# EasyEDA Pro project ProPrj_Y车Y形板_2025-09-30.epro, board 六边形主板
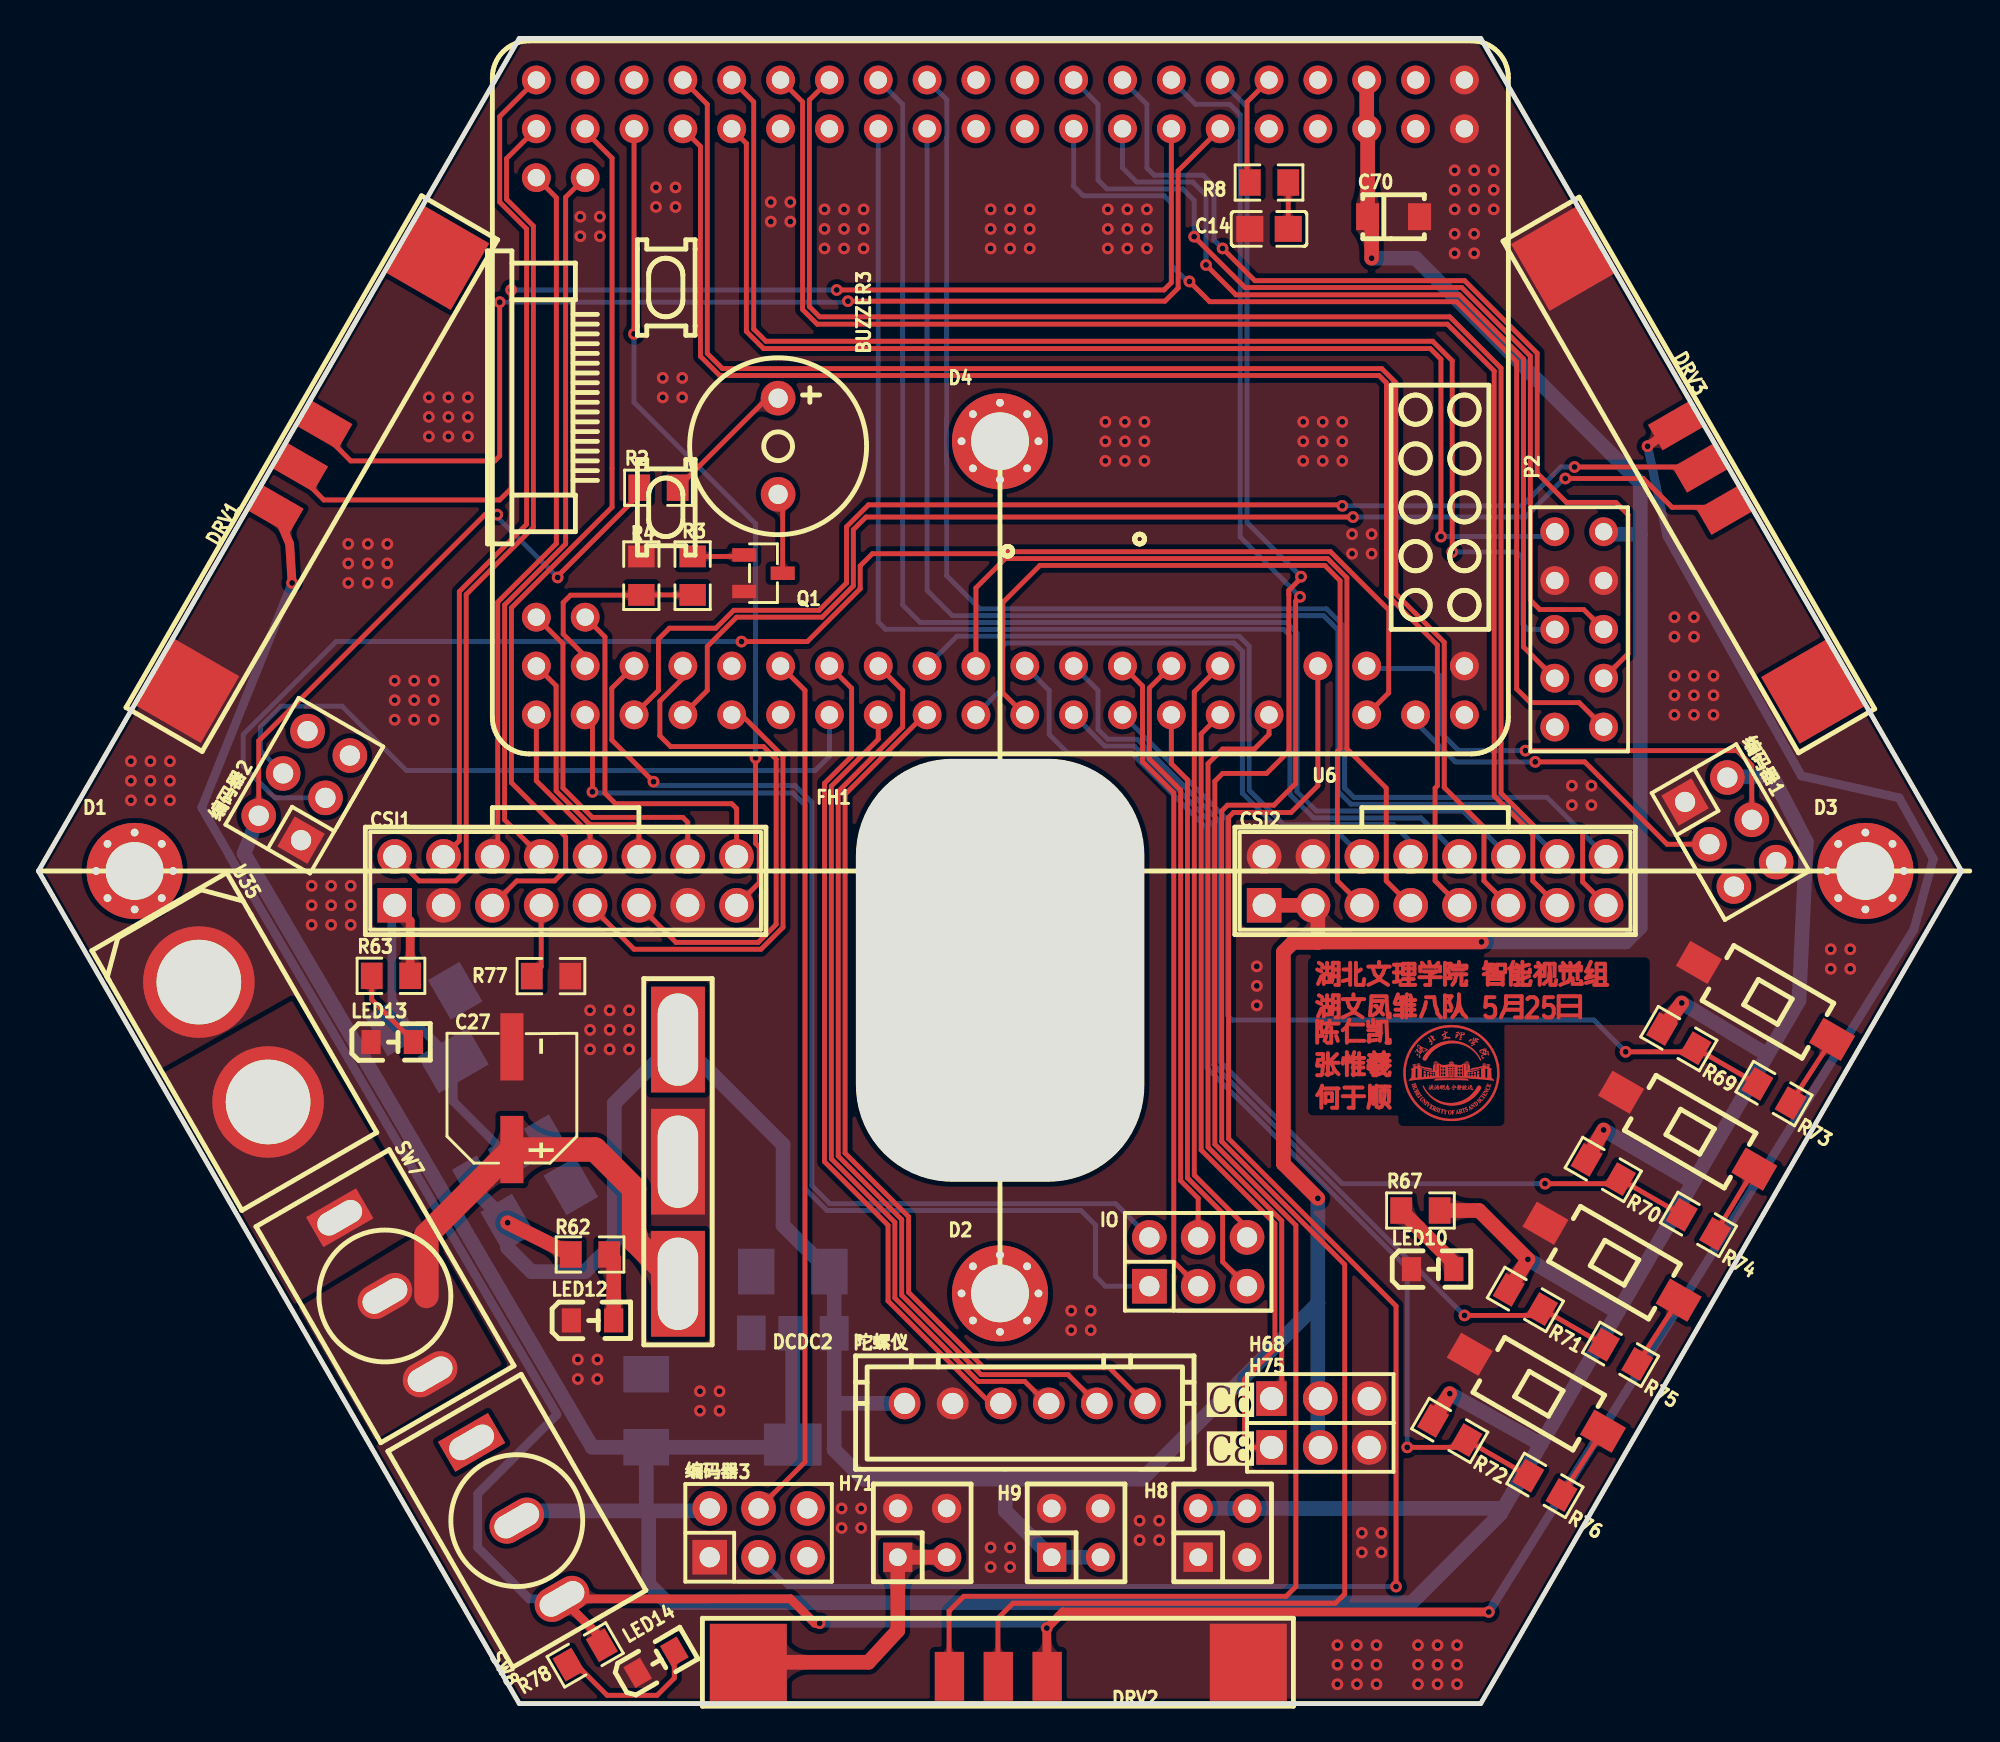
[diagram p14: board, top side]
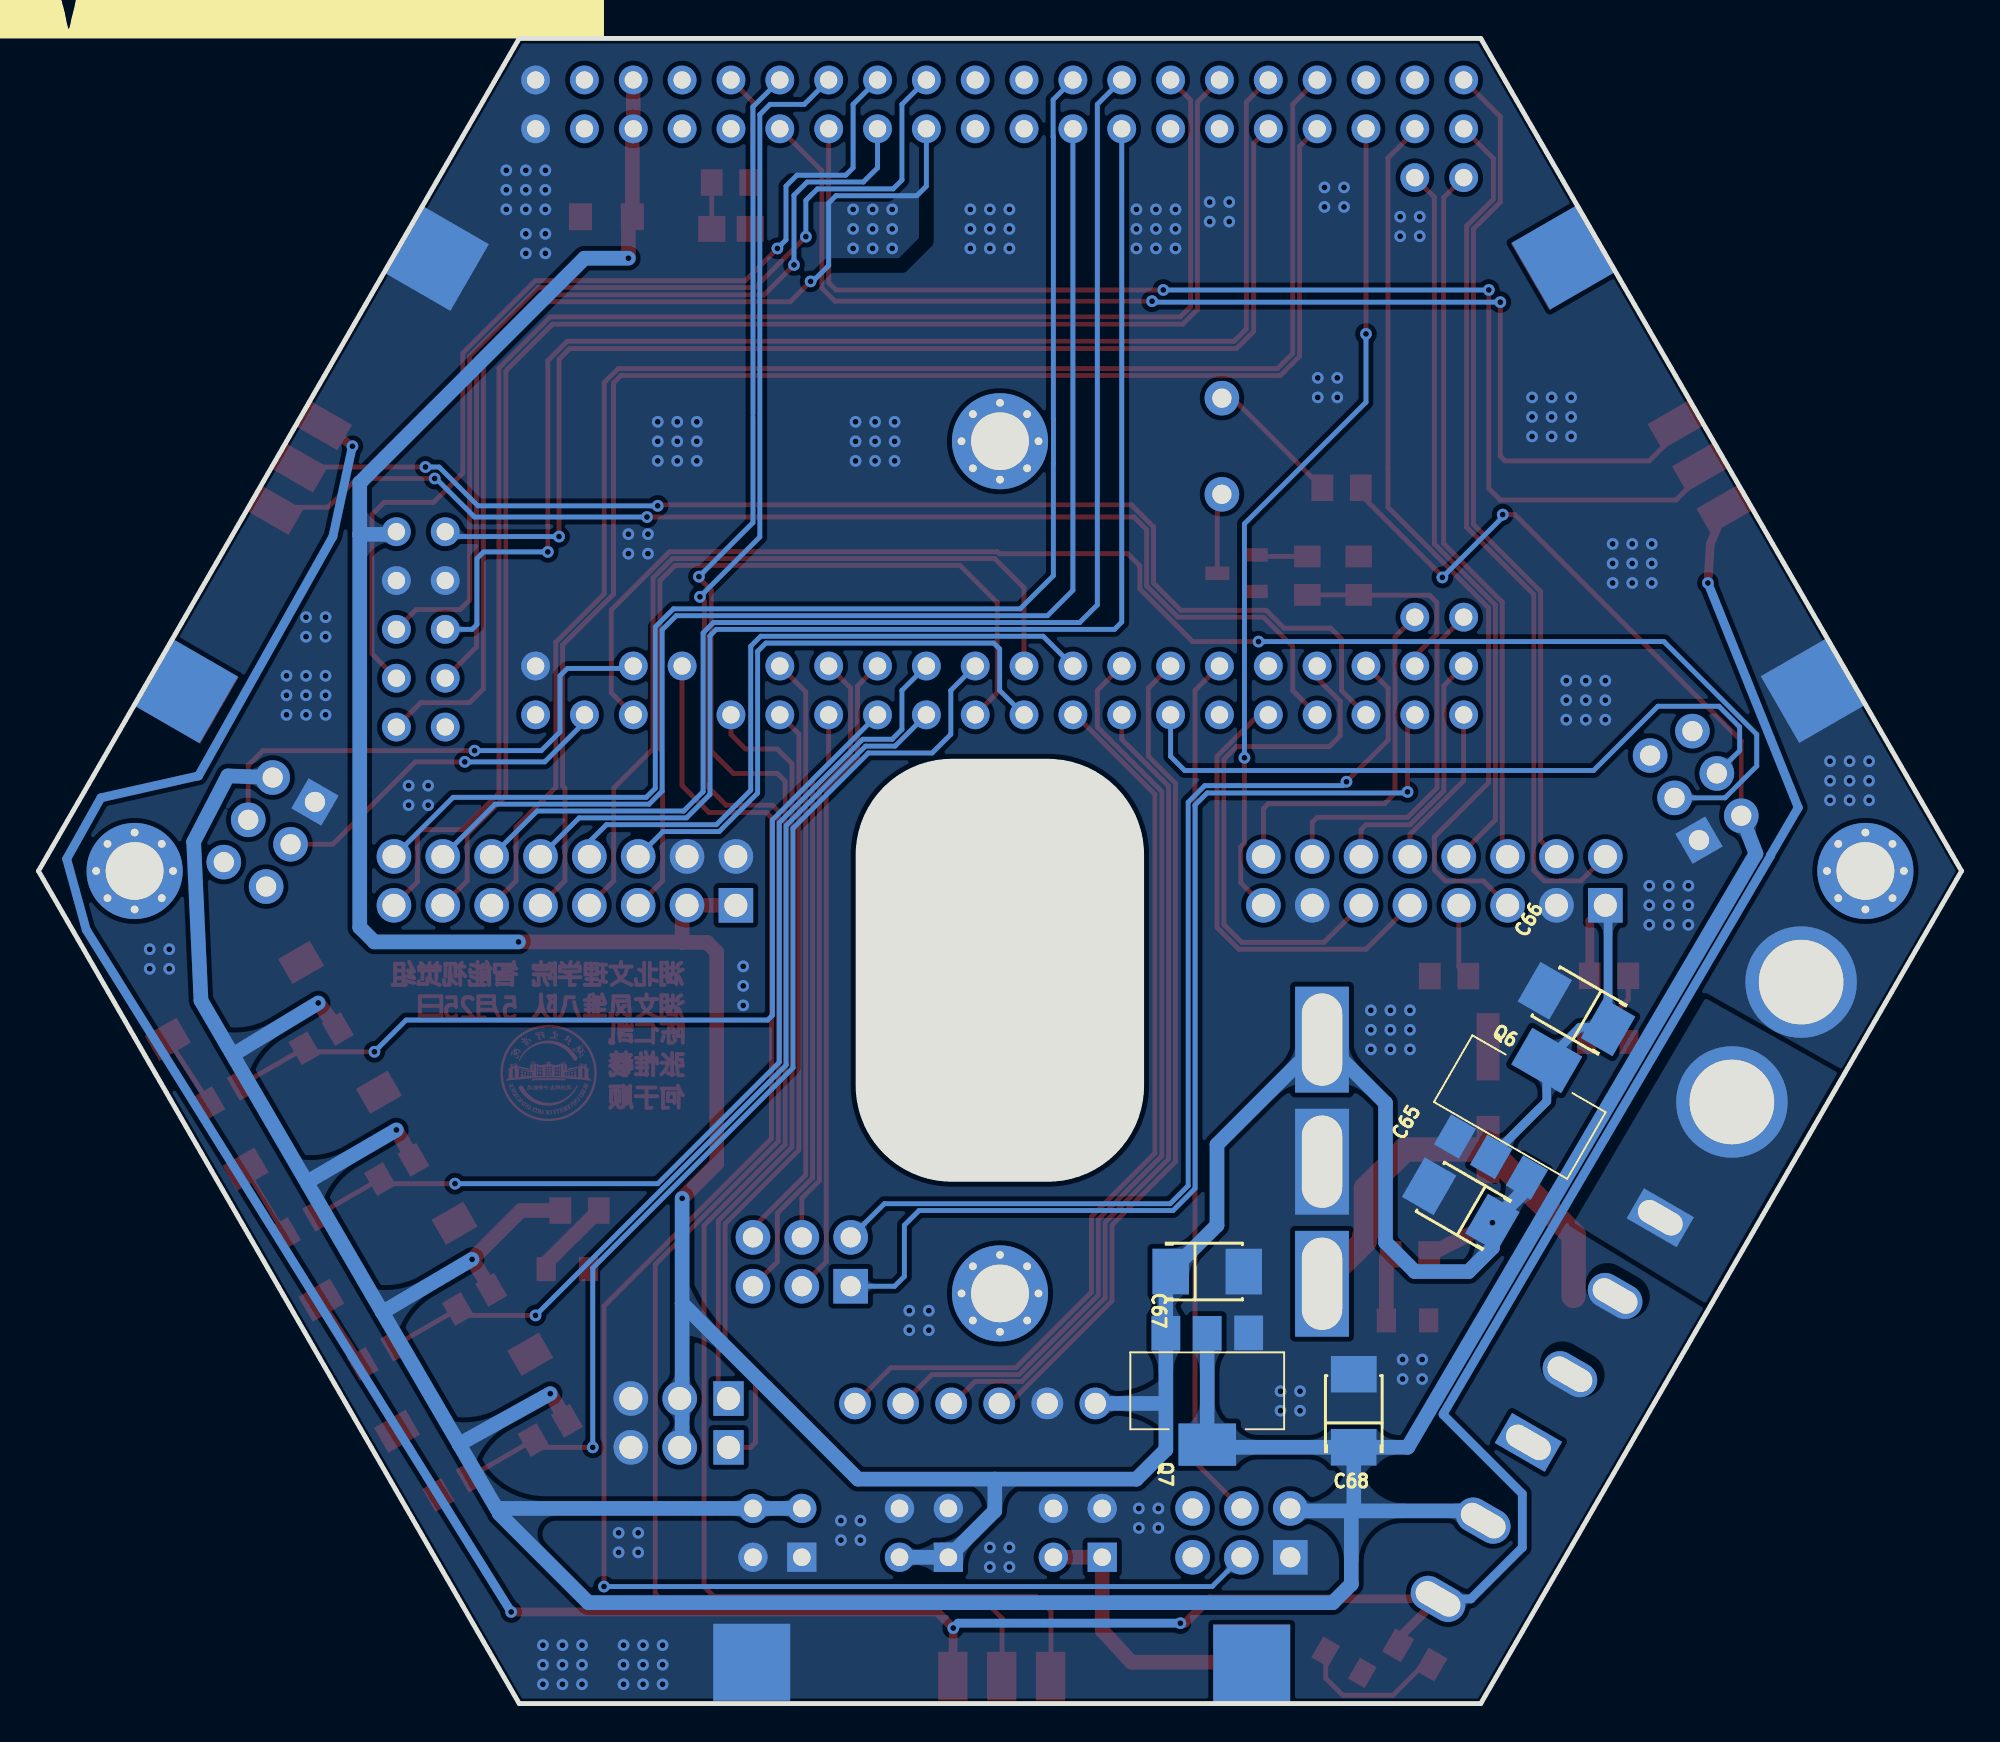
[diagram p15: board, bottom side, seen from below]

Outline 100 x 86.6 mm; copper layers: Top Layer, Bottom Layer. Coordinates in mm from the lower left corner of the outline.
Outline path: 0,43.3 25,86.6 75,86.6 100,43.3 75,0 25,0 0,43.3
Stack: Top Layer 0.035mm / Dielectric1 1.51mm FR4 er 4.5 / Bottom Layer 0.035mm

## Design rules (mm)
template: 自定义配置
spacing copperThickness1oz (default): track to track 0.102, other pairs 0.152 to 0.3
spacing copperThickness2oz: track to track 0.203, other pairs 0.152 to 0.3
track width copperThickness1oz (default): min 0.127, default 0.254, max 2.54
track width copperThickness2oz: min 0.203, default 0.254, max 2.54
differential pair differentialPair (default): width min 0.127, default 0.254, max 2.54; gap min 0.152, default 0.152
via viaSize (default): diameter min 0.5, default 0.61, max 10; hole min 0.3, default 0.305, max 6.3

## Placement (name value [footprint] x y rotation side)
BUZZER3  3kHz  [BUZ-TH_BD9.0-P5.00-D0.6-FD]  38.46 65.39 270 top
C1  TS-1101-C-W  [SW-SMD_L6.0-W3.3-LS8.0]  81.83 22.98 150 top
C12  TS-1101-C-W  [SW-SMD_L6.0-W3.3-LS8.0]  89.81 36.55 150 top
C13  TS-1101-C-W  [SW-SMD_L6.0-W3.3-LS8.0]  85.76 29.8 150 top
C14  10uF  [C0805]  63.99 76.7 0 top
C15  TS-1101-C-W  [SW-SMD_L6.0-W3.3-LS8.0]  77.89 16.17 150 top
C27  470uF  [CAP-SMD_BD6.3-L6.6-W6.6-LS7.2-FD]  24.62 31.48 90 top
C65  10uF  [CAP-SMD_L3.5-W2.8-R-RD]  26.04 25.96 210 bottom
C66  10uF  [CAP-SMD_L3.5-W2.8-R-RD]  20.02 36.12 210 bottom
C67  10uF  [CAP-SMD_L3.5-W2.8-R-RD]  39.22 22.47 0 bottom
C68  10uF  [CAP-SMD_L3.5-W2.8-R-RD]  31.6 15.23 270 bottom
C70  22uF  [CAP-SMD_L3.2-W1.6]  70.47 77.33 0 top
CSI1  2.54-2*8P针  [HDR-TH_16P-P2.54-V-M-R2-C8-S2.54]  27.41 42.79 0 top
CSI2  2.54-2*8P针  [HDR-TH_16P-P2.54-V-M-R2-C8-S2.54]  72.62 42.79 0 top
D1  -  [M3]  5 43.3 0 top
D2  -  [M3]  50 21.32 0 top
D3  -  [M3]  95 43.3 0 top
D4  -  [M3]  50 65.65 0 top
DCDC2  -  [TPS54540DC插槽]  33.25 21.83 180 top
DRV1  -  [DRV8701连接焊盘]  4.55 51.8 60 top
DRV2  -  [DRV8701连接焊盘]  65.26 -0.14 180 top
DRV3  -  [DRV8701连接焊盘]  80.12 78.35 300 top
FH1  智能车逐飞摄像头固定孔  [智能车逐飞摄像头支架固定孔]  50 40.37 0 top
H8  -  [HDR-TH_4P-P2.54-V-M-R2-C2-S2.54-1]  61.58 8.88 0 top
H9  -  [HDR-TH_4P-P2.54-V-M-R2-C2-S2.54-1]  53.96 8.88 0 top
H68  77311-102-03LF  [HDR-TH_3P-P2.54-V-M-1]  66.66 15.86 0 top
H71  -  [HDR-TH_4P-P2.54-V-M-R2-C2-S2.54-1]  45.96 8.88 0 top
H75  77311-102-03LF  [HDR-TH_3P-P2.54-V-M-1]  66.66 13.32 0 top
IO  67997-206HLF  [HDR-TH_6P-P2.54-V-M-R2-C3-S2.54-1]  60.31 22.98 0 top
LED10  NCD0805R1  [LED0805-RD]  72.5 22.59 0 top
LED12  NCD0805R1  [LED0805-RD]  28.81 19.93 0 top
LED13  NCD0805R1  [LED0805-RD]  18.4 34.41 0 top
LED14  NCD0805R1  [LED0805-RD]  32.11 2.15 30 top
P2  Header-D-F 2x5P  [HDR2X5-F]  78.85 60.95 270 top
Q1  S8050  [SOT-23-3_L2.9-W1.3-P1.90-LS2.4-BR]  37.7 58.79 180 top
Q6  AMS1117-3.3V  [AMS1117]  23.02 30.93 210 bottom
Q7  AMS1117-3.3V  [AMS1117]  39.22 16.37 0 bottom
R2  10R  [R0805]  32.24 63.23 0 top
R3  4.7K  [R0805]  34.02 58.66 90 top
R4  10K  [R0805]  31.35 58.66 90 top
R8  10K  [R0805]  63.99 79.11 0 top
R62  4.7K  [R0805]  28.68 23.36 180 top
R63  4.7K  [R0805]  18.33 37.85 0 top
R67  2.2K  [R0805]  71.86 25.64 0 top
R69  1kΩ  [R0805]  85.3 34.58 150 top
R70  1kΩ  [R0805]  81.37 27.78 150 top
R71  1kΩ  [R0805]  77.32 21.02 150 top
R72  1kΩ  [R0805]  73.39 14.2 150 top
R73  100Ω  [R0805]  90.25 31.73 150 top
R74  100Ω  [R0805]  86.32 24.92 150 top
R75  100Ω  [R0805]  82.27 18.16 150 top
R76  100Ω  [R0805]  78.34 11.35 150 top
R77  10K  [R0805]  26.65 37.83 0 top
R78  2.2K  [R0805]  28.43 2.53 30 top
SW7  MT-0-103-A101-M200-RS+PJ  [SW-TH_MT-0-103-A101-M200-RS]  18.02 21.2 300 top
SW8  MT-0-103-A101-M200-RS+PJ  [SW-TH_MT-0-103-A101-M200-RS]  24.87 9.51 300 top
U6  -  [AUFE_RT1064]  50.02 67.93 180 top
U35  XT60  [CONN-TH_XT60]  10.14 34.41 300 top
编码器1  67997-206HLF  [HDR-TH_6P-P2.54-V-M-R2-C3-S2.54-1]  87.99 45.33 300 top
编码器2  67997-206HLF  [HDR-TH_6P-P2.54-V-M-R2-C3-S2.54-1]  13.82 47.74 60 top
编码器3  67997-206HLF  [HDR-TH_6P-P2.54-V-M-R2-C3-S2.54-1]  37.45 8.88 0 top
陀螺仪  WAFER-XH2.54-6PZZ  [CONN-TH_XH2.54-6P]  51.29 15.61 0 top

## Footprints (pads in the part's own frame, mm; a bottom-side part is the same pattern mirrored in y, then rotated)
AMS1117
  rect 1.5x1.8 smd: 1(-2.153,-2.905) 2(0.003,-2.884) 3(2.153,-2.884)
  rect 3x2.2 smd: 2(0,2.905)
AUFE_RT1064
  round 1.5 hole 0.9x0.9: 1(-24.13,-16.51) 2(-24.13,-13.97) 3(-21.59,-16.51) 4(-21.59,-13.97) 5(-19.05,-16.51) 6(-19.05,-13.97) 7(-16.51,-16.51) 8(-16.51,-13.97) 9(-13.97,-16.51) 10(-13.97,-13.97) 11(-11.43,-16.51) 12(-11.43,-13.97) 13(-8.89,-16.51) 14(-8.89,-13.97) 15(-6.35,-16.51) 16(-6.35,-13.97) 17(-3.81,-16.51) 18(-3.81,-13.97) 19(-1.27,-16.51) 20(-1.27,-13.97) 21(1.27,-16.51) 22(1.27,-13.97) 23(3.81,-16.51) 24(3.81,-13.97) 25(6.35,-16.51) 26(6.35,-13.97) 27(8.89,-16.51) 28(8.89,-13.97) 29(11.43,-16.51) 30(11.43,-13.97) 31(13.97,-16.51) 32(13.97,-13.97) 33(16.51,-16.51) 34(16.51,-13.97) 35(19.05,-16.51) 36(19.05,-13.97) 37(21.59,-16.51) 38(21.59,-13.97) 39(24.13,-16.51) 40(24.13,-13.97) 41(21.59,-11.43) 42(24.13,-11.43) 43(24.13,11.43) 44(21.59,11.43) 45(24.13,13.97) 46(24.13,16.51) 47(21.59,13.97) 48(21.59,16.51) 49(19.05,13.97) 50(19.05,16.51) 51(16.51,13.97) 52(16.51,16.51) 53(13.97,13.97) 54(13.97,16.51) 55(11.43,13.97) 56(11.43,16.51) 57(8.89,13.97) 58(8.89,16.51) 59(6.35,13.97) 60(6.35,16.51) 61(3.81,13.97) 62(3.81,16.51) 63(1.27,13.97) 64(1.27,16.51) 65(-1.27,13.97) 66(-1.27,16.51) 67(-3.81,13.97) 68(-3.81,16.51) 69(-6.35,13.97) 70(-6.35,16.51) 71(-8.89,13.97) 72(-8.89,16.51) 73(-11.43,13.97) 74(-11.43,16.51) 76(-13.97,16.51) 77(-16.51,13.97) 79(-19.05,13.97) 80(-19.05,16.51) 82(-21.59,16.51) 83(-24.13,13.97) 84(-24.13,16.51)
BUZ-TH_BD9.0-P5.00-D0.6-FD
  round 1.8 hole 1: 1(-2.5,0) 2(2.5,0)
C0805
  rect 1.41x1.35 smd: 1(-1,0) 2(1,0)
CAP-SMD_BD6.3-L6.6-W6.6-LS7.2-FD
  rect 3.5x1.2 smd: 1(-2.67,0) 2(2.67,0)
CAP-SMD_L3.2-W1.6
  rect 1.2x1.4 smd: 1(-1.35,0) 2(1.35,0)
CAP-SMD_L3.5-W2.8-R-RD
  rect 1.9x2.376 smd: 1(1.899,0) 2(-1.899,0)
CONN-TH_XH2.54-6P
  round 1.65 hole 1.1: 1(-6.25,0) 2(-3.75,0) 3(-1.25,0) 4(1.25,0) 5(3.75,0) 6(6.25,0)
CONN-TH_XT60
  round 5.8 hole 4.4: 1(-3.6,0) 2(3.6,0)
DRV8701连接焊盘
  rect 4x4 smd far side: 1(28.348,-2.24) 2(2.348,-2.286)
  rect 4x4 smd: 1(28.348,-2.286) 2(2.348,-2.286)
  rect 1.524x2.54 smd: 3(17.888,-1.556) 4(15.348,-1.556) 5(12.808,-1.556)
HDR2X5-F
  round 1.5 hole 0.9: 1(0,0) 2(0,2.54) 3(2.54,0) 4(2.54,2.54) 5(5.08,0) 6(5.08,2.54) 7(7.62,0) 8(7.62,2.54) 9(10.16,0) 10(10.16,2.54)
HDR-TH_3P-P2.54-V-M-1
  rect 1.575x1.8 hole 1.2: 1(-2.54,0)
  round 1.8 hole 1.2: 2(0,0) 3(2.54,0)
HDR-TH_4P-P2.54-V-M-R2-C2-S2.54-1
  rect 1.524x1.524 hole 0.914: 1(-1.27,-1.27)
  round 1.524 hole 0.914: 2(-1.27,1.27) 3(1.27,-1.27) 4(1.27,1.27)
HDR-TH_6P-P2.54-V-M-R2-C3-S2.54-1
  rect 1.8x1.8 hole 1.05: 1(-2.54,-1.27)
  round 1.8 hole 1.05: 2(-2.54,1.27) 3(0,-1.27) 4(0,1.27) 5(2.54,-1.27) 6(2.54,1.27)
HDR-TH_16P-P2.54-V-M-R2-C8-S2.54
  rect 1.8x1.8 hole 1.2: 1(-8.89,-1.27)
  round 1.8 hole 1.2: 2(-8.89,1.27) 3(-6.35,-1.27) 4(-6.35,1.27) 5(-3.81,-1.27) 6(-3.81,1.27) 7(-1.27,-1.27) 8(-1.27,1.27) 9(1.27,-1.27) 10(1.27,1.27) 11(3.81,-1.27) 12(3.81,1.27) 13(6.35,-1.27) 14(6.35,1.27) 15(8.89,-1.27) 16(8.89,1.27)
LED0805-RD
  rect 1x1.25 smd: 1(-1.1,0) 2(1.1,0)
M3
  round 0.6 hole 0.405x0.4: 1(-2,0.007) 1(-1.41,1.417) 1(-1.41,-1.403) 1(0,2.007) 1(0,-1.993) 1(1.41,1.417) 1(1.41,-1.403) 1(2,0.007)
  round 5 hole 3.005x3: 1(0,0.007)
R0805
  rect 1.133x1.377 smd: 1(-1,0) 2(1,0)
SOT-23-3_L2.9-W1.3-P1.90-LS2.4-BR
  rect 1.25x0.7 smd: 1(1,-0.95) 2(1,0.95) 3(-1,0)
SW-SMD_L6.0-W3.3-LS8.0
  rect 1.9x1.5 smd: 1(-4,0) 2(4,0)
SW-TH_MT-0-103-A101-M200-RS
  rect 1.8x3 hole 1.2x2.5: 1(-4.7,0)
  oval 1.8x3 hole 1.2x2.5: 2(0,0) 3(4.7,0)
TPS54540DC插槽
  rect 2.8x5.5 hole 2.1x4.8: 1(0,0) 2(0,-6.35) 3(0,-12.7)

## Nets
As in the schematic.

Pads without a net: D1 1; D2 1; D3 1; D4 1; P2 9; SW8 1; U6 3 4 7 8 10 21 22 28 30 35 37 53 56; 编码器1 5 6; 编码器2 5 6; 编码器3 5 6

## Via types
v1: diameter 0.61, hole 0.305, Top Layer to Bottom Layer, 245 vias

## Routing (per net, layer and track width the routed paths; a pad name or vN(x,y) marks a point on that pad's centre or on a via; arc(x,y) is an arc through that point)
3V3: length 244.7
  Top Layer w0.254: v1(27,58.57) 27,58.63 31.24,62.88 R2.1 ; 编码器2.2 11.45,50.07 23.22,61.84 v1(23.86,61.84)
  Top Layer w0.762: v1(85.45,36.44) R69.2 ; R71.2 v1(77.45,23.1) 74.91,25.64 R67.2 ; v1(73.39,16.12) R72.2 ; v1(81.39,29.83) R70.2
  Bottom Layer w0.254: v1(23.86,61.84) 23.86,61.71 v1(27,58.57)
  Bottom Layer w0.762: 76.05,9.89 71.41,5.25 32.7,5.25 31.73,6.21 31.73,9.89 ; 78.12,13.49 76.18,10.15 ; 78.12,13.49 82.12,20.35 ; 78.12,13.49 v1(73.39,16.12) ; 89.64,33.9 v1(85.45,36.44) ; H8.2 H8.4 76.05,10.15 76.12,10.08 ; SW8.2 25.38,10.02 31.6,10.02 C68.1 ; 82.12,20.35 v1(77.45,23.1) ; 82.12,20.35 91.55,36.56 91.93,44.82 90.15,48.25 编码器1.2 ; 85.96,27.17 v1(81.39,29.83) ; 31.73,10.02 34.78,10.02 编码器3.2 ; C68.1 39.09,13.33 Q7.2 39.22,19.25 39.23,19.26 ; C68.1 28.79,13.33 10.69,44.21 编码器2.2
GND:
  vias: v1(4.81,49.01) v1(4.81,47.99) v1(4.81,46.98) v1(5.82,49.01) v1(5.82,47.99) v1(5.82,46.98) v1(6.84,49.01) v1(6.84,47.99) v1(6.84,46.98) v1(14.2,42.53) v1(14.2,41.52) v1(14.2,40.5) v1(15.22,42.53) v1(15.22,41.52) v1(15.22,40.5) v1(16.11,60.31) v1(16.11,59.3) v1(16.11,58.28) v1(16.24,42.53) v1(16.24,41.52) v1(16.24,40.5) v1(17.13,60.31) v1(17.13,59.3) v1(17.13,58.28) v1(18.14,60.31) v1(18.14,59.3) v1(18.14,58.28) v1(18.52,53.2) v1(18.52,52.19) v1(18.52,51.17) v1(19.54,53.2) v1(19.54,52.19) v1(19.54,51.17) v1(20.3,67.93) v1(20.3,66.92) v1(20.3,65.9) v1(20.56,53.2) v1(20.56,52.19) v1(20.56,51.17) v1(21.32,67.93) v1(21.32,66.92) v1(21.32,65.9) v1(22.33,67.93) v1(22.33,66.92) v1(22.33,65.9) v1(28.05,17.9) v1(28.05,16.88) v1(28.17,77.33) v1(28.17,76.32) v1(28.68,36.06) v1(28.68,35.04) v1(28.68,34.02) v1(29.06,17.9) v1(29.06,16.88) v1(29.19,77.33) v1(29.19,76.32) v1(29.7,36.06) v1(29.7,35.04) v1(29.7,34.02) v1(30.72,36.06) v1(30.72,35.04) v1(30.72,34.02) v1(32.11,78.86) v1(32.11,77.84) v1(32.46,68.95) v1(32.46,67.93) v1(33.13,78.86) v1(33.13,77.84) v1(33.48,68.95) v1(33.48,67.93) v1(34.4,16.24) v1(34.4,15.23) v1(35.41,16.24) v1(35.41,15.23) v1(38.08,78.09) v1(38.08,77.08) v1(39.1,78.09) v1(39.1,77.08) v1(40.88,77.71) v1(40.88,76.7) v1(40.88,75.68) v1(41.76,10.15) v1(41.76,9.13) v1(41.89,77.71) v1(41.89,76.7) v1(41.89,75.68) v1(42.78,10.15) v1(42.78,9.13) v1(42.91,77.71) v1(42.91,76.7) v1(42.91,75.68) v1(49.51,77.71) v1(49.51,76.7) v1(49.51,75.68) v1(49.51,8.12) v1(49.51,7.1) v1(50.53,77.71) v1(50.53,76.7) v1(50.53,75.68) v1(50.53,8.12) v1(50.53,7.1) v1(51.54,77.71) v1(51.54,76.7) v1(51.54,75.68) v1(53.7,20.44) v1(53.7,19.42) v1(54.72,20.44) v1(54.72,19.42) v1(55.48,66.66) v1(55.48,65.65) v1(55.48,64.63) v1(55.61,77.71) v1(55.61,76.7) v1(55.61,75.68) v1(56.5,66.66) v1(56.5,65.65) v1(56.5,64.63) v1(56.62,77.71) v1(56.62,76.7) v1(56.62,75.68) v1(57.26,9.51) v1(57.26,8.5) v1(57.51,66.66) v1(57.51,65.65) v1(57.51,64.63) v1(57.64,77.71) v1(57.64,76.7) v1(57.64,75.68) v1(58.27,9.51) v1(58.27,8.5) v1(63.35,38.34) v1(63.35,37.33) v1(63.35,36.31) v1(65.77,66.66) v1(65.77,65.65) v1(65.77,64.63) v1(66.78,66.66) v1(66.78,65.65) v1(66.78,64.63) v1(67.54,3.04) v1(67.54,2.02) v1(67.54,1) v1(67.8,66.66) v1(67.8,65.65) v1(67.8,64.63) v1(68.31,60.82) v1(68.31,59.81) v1(68.56,3.04) v1(68.56,2.02) v1(68.56,1) v1(68.81,8.88) v1(68.81,7.86) v1(69.32,60.82) v1(69.32,59.81) v1(69.58,3.04) v1(69.58,2.02) v1(69.58,1) v1(69.83,8.88) v1(69.83,7.86) v1(71.74,3.04) v1(71.74,2.02) v1(71.74,1) v1(72.75,3.04) v1(72.75,2.02) v1(72.75,1) v1(73.64,79.74) v1(73.64,78.73) v1(73.64,77.71) v1(73.64,76.44) v1(73.64,75.43) v1(73.77,3.04) v1(73.77,2.02) v1(73.77,1) v1(74.66,79.74) v1(74.66,78.73) v1(74.66,77.71) v1(74.66,76.44) v1(74.66,75.43) v1(75.67,79.74) v1(75.67,78.73) v1(75.67,77.71) v1(79.74,47.74) v1(79.74,46.72) v1(80.75,47.74) v1(80.75,46.72) v1(85.07,56.5) v1(85.07,55.49) v1(85.07,53.46) v1(85.07,52.44) v1(85.07,51.42) v1(86.09,56.5) v1(86.09,55.49) v1(86.09,53.46) v1(86.09,52.44) v1(86.09,51.42) v1(87.1,53.46) v1(87.1,52.44) v1(87.1,51.42) v1(93.2,39.23) v1(93.2,38.22) v1(94.22,39.23) v1(94.22,38.22)
VCC5V: length 195.8
  Top Layer w0.762: 66.53,39.59 66.53,41.26 CSI2.3 CSI2.1 ; 66.53,39.59 65.23,39.59 64.73,39.09 64.73,28.07 v1(66.53,26.28) ; 66.53,39.59 66.56,39.61 v1(75.04,39.61) ; v1(24.39,25.01) R62.2 ; v1(69.32,75.17) 69.32,77.12 C70.1 69.12,81.86 69.07,81.9 69.07,84.44
  Bottom Layer w0.762: 22.6,27.36 22.6,26.8 v1(24.39,25.01) 24.39,23.71 25.64,22.47 28.43,22.47 29.95,23.99 29.95,31.23 DCDC2.3 38.72,29.07 38.72,24.87 C67.1 41.38,22.21 Q7.3 41.38,13.2 42.91,11.67 50.27,11.67 ; v1(75.04,39.61) 82.53,39.61 83.29,40.37 83.29,60.81 ; 83.29,60.81 81.53,60.81 P2.2 ; 83.29,60.81 83.29,63.49 71.61,75.17 v1(69.32,75.17) ; 66.53,15.99 H68.2 ; 66.53,15.99 66.53,20.82 ; 66.53,15.99 66.53,13.45 H75.2 ; 50.27,11.67 50.27,10.02 H9.1 H9.3 ; 50.27,11.67 57.38,11.67 66.53,20.82 ; 41.51,15.61 陀螺仪.1 ; 66.53,20.82 v1(66.53,26.28)
VCCBAT: length 37.4
  Top Layer w0.762: 47.22,7.61 H71.1 44.69,3.8 43.16,2.15 DRV2.1
  Top Layer w1.27: 20.17,21.2 20.17,24.37 C27.1 28.94,28.81 30.97,26.79 30.97,24.44 31.04,24.37 31.04,24.05 DCDC2.1
B0: length 71.5
  Bottom Layer w0.254: CSI2.16 78.44,47.13 68.4,47.13 67.93,47.6 67.93,55.99 66.98,56.94 48.95,56.94 47.22,58.66 47.22,64.5 47.22,64.5 47.22,66.81 47.22,66.81 47.22,81.46 47.24,81.48 47.24,83.41 46.21,84.44
B1: length 67.4
  Bottom Layer w0.254: CSI2.14 76.26,46.78 68.25,46.78 67.57,47.45 67.57,55.84 66.83,56.58 47.53,56.58 46.21,57.9 U6.24
B2: length 69.6
  Bottom Layer w0.254: 43.67,84.44 44.94,83.17 44.94,57.14 45.85,56.22 64.9,56.22 65.44,55.68 65.44,47.43 66.45,46.42 74.07,46.42 CSI2.12
B3: length 65.8
  Bottom Layer w0.254: U6.26 43.67,56.25 44.05,55.87 64.75,55.87 65.08,55.54 65.08,47.28 66.3,46.06 71.89,46.06 CSI2.10
B9: length 54.7
  Top Layer w0.254: v1(31.98,47.94) 29.81,50.11 29.81,52.81 30.97,53.96
  Bottom Layer w0.254: v1(31.98,47.94) 32.19,47.74 39.35,47.74 40.22,46.88 40.22,26.93 41.15,26 56.01,26 IO.2
B10: length 57
  Top Layer w0.254: v1(28.81,47.42) 28.81,51.04 U6.48
  Bottom Layer w0.254: v1(28.81,47.42) 28.86,47.36 39.23,47.36 39.86,46.73 39.86,26.79 41,25.64 54.21,25.64 54.97,24.88 54.97,22.21 55.48,21.71 IO.1
B11: length 10.8
  Top Layer w0.254: U6.47 28.43,54.48 27.29,55.62 27.29,57.27 27.67,57.65 31.28,57.65 31.35,57.58 R4.1 R3.1
B12_TX: length 78.9
  Top Layer w0.254: CSI2.13 77.71,42.79 77.71,45.2 75.7,47.21 75.7,69.31 73.26,71.74 40.49,71.74 39.73,72.51 39.73,83.3 38.59,84.44
B13_RX: length 81
  Top Layer w0.254: 41.13,84.44 40.09,83.4 40.09,72.66 40.62,72.12 73.39,72.12 76.05,69.46 76.05,47.35 77.95,45.45 80.12,45.45 80.3,45.27 80.3,42.73 CSI2.15
B16: length 62.8
  Top Layer w0.254: U6.32 36.81,81.14 36.81,71.37 37.7,70.47 72.38,70.47 72.93,69.92 v1(72.93,60.69)
  Bottom Layer w0.254: v1(72.93,60.69) 78.59,60.69 P2.1
B17: length 69.4
  Top Layer w0.254: v1(73.51,59.9) 73.51,69.84 72.5,70.85 37.83,70.85 37.19,71.49 37.19,83.3 36.05,84.44
  Bottom Layer w0.254: v1(73.51,59.9) 76.85,59.9 77.2,59.55 77.2,56.12 77.45,55.87 P2.5
B18_TX: length 77.3
  Top Layer w0.254: CSI2.9 72.62,42.79 72.62,47.61 72.74,47.73 72.74,55.05 70.1,57.7 70.1,68.68 69.71,69.07 35.42,69.07 34.42,70.07 34.42,80.99 33.51,81.9
B19_RX: length 80.8
  Top Layer w0.254: 33.51,84.44 34.78,83.17 34.78,70.22 35.57,69.43 69.85,69.43 70.58,68.7 70.58,57.72 73.1,55.2 73.1,47.65 75.16,45.58 75.16,42.79 CSI2.11
B20: length 43.6
  Top Layer w0.254: CSI1.15 37.48,42.7 37.48,44.55 37.29,44.74 v1(37.29,49.19) ; v1(30.97,71.24) 30.97,81.9
  Bottom Layer w0.254: v1(37.29,49.19) 37.29,61.36 30.97,67.68 v1(30.97,71.24)
B22: length 47
  Top Layer w0.254: U6.38 28.43,81.78 29.83,80.38 29.83,62.22 24.59,56.99 24.59,47.89 27.41,45.07 27.41,43.36 26.84,42.79 24.87,42.79 CSI1.5
B24: length 45.7
  Top Layer w0.254: CSI1.2 19.79,42.79 21.7,42.79 22.24,43.33 22.24,57.69 25.74,61.18 25.74,76.84 24.34,78.24 24.34,80.35 25.89,81.9
B25: length 43.5
  Top Layer w0.254: CSI1.4 21.89,44.88 21.89,57.83 25.38,61.33 25.38,76.7 23.98,78.09 23.98,82.54 25.89,84.44
B26: length 37.3
  Top Layer w0.254: CSI1.6 23.86,44.06 23.88,44.08 23.88,57.29 26.93,60.33 26.93,78.32 25.89,79.36
B27: length 37.9
  Top Layer w0.254: 26.08,44.12 26.14,44.18 ; 26.08,44.12 CSI1.8 ; 26.08,44.12 24.24,45.96 24.24,57.14 27.41,60.31 27.41,78.35 U6.41
B28: length 8.5
  Top Layer w0.254: 25.89,51.42 25.89,47.99 28.68,45.2 CSI1.10
B29: length 13.5
  Top Layer w0.254: CSI1.12 31.22,45.45 30.97,45.71 28.68,45.71 26.92,47.47 26.92,52.93 25.89,53.96
B30: length 18.5
  Top Layer w0.254: CSI1.14 33.76,45.84 33.51,46.09 28.8,46.09 27.27,47.62 27.27,55.12 25.89,56.5
B31: length 19.2
  Top Layer w0.254: 28.43,56.5 29.46,55.47 29.46,47.35 30,46.8 36.05,46.8 36.3,46.55 CSI1.16
C0: length 18.3
  Top Layer w0.254: v1(77.83,48.98) 80.41,48.98 84.69,44.69 编码器1.3
  Bottom Layer w0.254: U6.82 71.61,51.04 73.67,48.98 v1(77.83,48.98)
C1: length 26.7
  Top Layer w0.254: v1(77.32,49.56) 88.33,49.56 89.09,48.8 编码器1.4
  Bottom Layer w0.254: v1(77.32,49.56) 73.85,49.56 72.88,50.53 72.88,53.46 72.5,53.84 69.2,53.84 69.07,53.96
C2: length 78
  Top Layer w0.254: 69.07,51.42 70.21,52.57 70.21,56.88 67.18,59.91 50.13,59.91 50.02,59.81 43.37,59.81 42.73,59.17 42.73,57.98 39.98,55.23 v1(36.56,55.23)
  Bottom Layer w0.254: v1(36.56,55.23) 15.47,55.23 10.65,50.41 10.65,48.76 12.3,47.11 编码器2.3
C3: length 88.9
  Top Layer w0.254: U6.77 66.53,47.74 65.13,46.34 62.14,46.34 61.88,46.09 61.88,29.38 70.59,20.67 v1(70.59,6.08)
  Bottom Layer w0.254: 编码器3.3 38.97,6.08 v1(70.59,6.08)
C6: length 39.7
  Top Layer w0.254: U6.76 63.99,50.41 63.23,49.65 61.58,49.65 60.82,48.88 60.82,28.94 64.65,25.1 64.65,16.4 H68.1
C7: length 31.4
  Top Layer w0.254: IO.6 62.85,24.74 60.1,27.49 60.1,52.62 U6.73
C8: length 42
  Top Layer w0.254: U6.74 60.46,50.43 60.46,28.79 64.3,24.95 64.3,18.46 62.72,16.88 62.72,13.58 62.97,13.32 H75.1
C9: length 31.2
  Top Layer w0.254: U6.71 57.77,52.82 57.77,49.14 59.39,47.51 59.39,27.19 60.31,26.28 IO.4
C10: length 31.3
  Top Layer w0.254: U6.72 58.91,48.88 59.75,48.04 59.75,27.34 61.58,25.51 61.58,22.98 IO.5
C11: length 33.9
  Top Layer w0.254: IO.3 59.04,22.98 59.04,47.36 57.41,48.99 57.41,52.92 U6.69
C12: length 46.8
  Top Layer w0.254: v1(82.53,33.9) 85.98,33.9 86.16,34.08 R73.2
  Bottom Layer w0.254: v1(82.53,33.9) 80.88,35.55 62.08,35.55 61.83,35.8 61.83,45.96 U6.70
C13: length 51.9
  Top Layer w0.254: v1(78.34,27.04) 82,27.04 R70.1 R74.2
  Bottom Layer w0.254: v1(78.34,27.04) 67.79,27.04 61.47,33.36 61.47,45.81 57.14,50.15 55.61,50.15 55.1,50.66 55.1,52.69 U6.67
C14: length 48.4
  Top Layer w0.254: v1(74.15,20.19) 77.85,20.19 R71.1 R75.2
  Bottom Layer w0.254: U6.68 55.46,49.8 56.99,49.8 61.12,45.67 61.12,33.21 74.14,20.19 v1(74.15,20.19)
C15: length 57.8
  Top Layer w0.254: R76.2 R72.1 73.87,13.32 v1(71.18,13.32)
  Bottom Layer w0.254: v1(71.18,13.32) 71.18,22.65 60.76,33.06 60.76,45.52 56.84,49.44 53.53,49.44 52.56,50.41 52.56,52.69 51.29,53.96
C16_TX: length 42.4
  Top Layer w0.254: CSI2.5 67.54,42.79 67.54,49.52 67.68,49.66 67.68,58.4 66.89,59.2 52.08,59.2 50.15,57.27 50.15,52.57 51.29,51.42
C17_RX: length 42.8
  Top Layer w0.254: CSI2.7 70.09,42.79 70.09,47.61 68.04,49.66 68.04,58.55 67.04,59.55 50.27,59.55 48.75,58.03 U6.63
C18: length 31.8
  Bottom Layer w0.254: CSI2.6 67.52,45.35 64.6,45.35 62.6,47.35 62.6,54.73 62.17,55.16 50.32,55.16 50.02,54.85 50.02,52.69 U6.64
C19: length 35.4
  Bottom Layer w0.254: CSI2.8 71.35,44.82 70.47,45.71 64.75,45.71 62.96,47.5 62.96,54.99 62.44,55.51 47.76,55.51 U6.61
C20: length 47.9
  Top Layer w0.254: 陀螺仪.6 55.68,17.46 49.17,17.46 45.25,21.39 45.25,25.32 41.94,28.62 41.94,47.29 46.08,51.42 U6.62
C21: length 48.5
  Top Layer w0.254: U6.59 44.94,52.69 44.94,50.79 41.59,47.44 41.59,28.48 44.89,25.18 44.89,21.24 49.02,17.11 53.54,17.11 陀螺仪.5
C22: length 43
  Top Layer w0.254: U6.60 43.67,50.15 41.23,47.72 41.23,28.33 44.53,25.03 44.53,21.09 48.87,16.75 51.29,16.75 52.43,15.61 陀螺仪.4
C23: length 43.5
  Top Layer w0.254: 41.13,53.96 42.28,52.81 42.28,49.27 40.88,47.86 40.88,28.18 44.18,24.88 44.18,20.94 49.51,15.61 陀螺仪.3
C24: length 36.8
  Bottom Layer w0.254: 41.13,51.42 41.13,49.26 40.39,48.53 19.13,48.53 15.79,51.87 12.61,51.87 11.54,50.79 11.54,49.56 12.72,48.38
C25: length 45.3
  Top Layer w0.254: 编码器3.4 39.86,12.56 39.86,52.69 U6.55
C28: length 23.9
  Top Layer w0.254: CSI1.9 30.97,39.23 37.57,39.23 38.72,40.37 38.72,49.26 36.56,51.42 U6.54
C29: length 27.6
  Top Layer w0.254: 33.51,53.96 33.51,53.33 32.31,52.13 32.31,50.33 32.87,49.77 37.7,49.77 38.36,49.11 38.36,40.52 37.43,39.59 33.15,39.59 CSI1.11
C30: length 62.8
  Top Layer w0.254: 87.49,62.1 87.38,62.22 84.94,62.22 83.45,63.72 v1(79.4,63.72) ; 33.51,51.42 34.78,52.69 34.78,54.98 36.3,56.5 40.75,56.5 42.37,58.13 42.37,61.05 43.03,61.71 v1(68.36,61.71)
  Bottom Layer w0.254: v1(68.36,61.71) 77.32,61.71 79.33,63.72 v1(79.4,63.72)
C31: length 64.6
  Top Layer w0.254: 30.97,51.42 32.24,52.69 32.24,55.23 ; 86.22,64.3 86.22,63.75 85.66,64.31 v1(79.88,64.31) ; 32.24,55.36 32.81,55.93 35.23,55.93 36.16,56.86 40.6,56.86 42.02,58.28 42.02,61.2 43.16,62.35 67.75,62.35 v1(67.8,62.29)
  Bottom Layer w0.254: v1(67.8,62.29) 77.15,62.29 79.16,64.31 v1(79.88,64.31)
CR: length 2.4
  Top Layer w0.254: C14.2 R8.2
CSI-3V3: length 20.5
  Top Layer w0.457: R63.2 19.33,40.71 CSI1.1
  Bottom Layer w0.457: CSI1.1 18.38,41.37 C66.1 19.84,35.17 21.57,33.45 21.57,31.32 Q6.2
D0: length 64.9
  Top Layer w0.254: 13.79,64.29 13.79,63.64 14.84,62.6 23.98,62.6 24.58,63.2 v1(24.58,73.52) ; U6.14 58.91,73.9 58.53,73.52 v1(41.51,73.52)
  Bottom Layer w0.254: v1(41.51,73.52) v1(24.58,73.52)
D1: length 109.9
  Top Layer w0.254: 49.91,1.42 49.89,1.44 49.89,4.43 50.68,5.22 67.44,5.22 67.93,5.7 67.93,22.83 61.53,29.23 61.53,46.42 61.83,46.72 64.24,46.72 65.37,47.86 65.37,57.33 v1(65.6,57.56)
  Bottom Layer w0.254: 58.91,84.44 60.18,83.17 61.96,83.17 62.49,82.64 62.49,60.67 v1(65.6,57.56)
D2: length 63
  Top Layer w0.254: U6.12 59.26,79.72 59.26,73.62 58.58,72.94 v1(42.09,72.94) ; 15.06,66.49 15.06,65.8 16.24,64.63 23.73,64.63 23.98,64.89 v1(23.98,72.89)
  Bottom Layer w0.254: v1(23.98,72.89) 42.04,72.89 v1(42.09,72.94)
D3: length 106.9
  Top Layer w0.254: v1(65.66,58.61) 65.66,58.54 65.01,57.89 65.01,57.7 65.02,57.7 65.02,49.53 63.86,48.38 61.58,48.38 61.17,47.97 61.17,29.09 65.39,24.87 65.39,6.08 64.88,5.58 48.11,5.58 47.35,4.81 47.35,1.44 47.37,1.42
  Bottom Layer w0.254: 62.85,66.92 62.85,61.42 v1(65.66,58.61) ; 61.45,84.44 62.85,83.05 62.85,67.04
D12: length 51.9
  Top Layer w0.254: P2.8 82.66,54.6 82.66,61.84 82.02,62.47 79.46,62.47 77.93,64 77.93,70.23 74.16,74 63.25,74 v1(61.58,75.68)
  Bottom Layer w0.254: v1(61.58,75.68) 61.13,76.13 61.13,78.92 60.56,79.49 58.02,79.49 57.64,79.87 57.64,83.17 56.37,84.44
D13: length 46.4
  Top Layer w0.254: P2.7 77.22,54.95 77.22,69.94 73.89,73.27 62.27,73.27 v1(60.71,74.82)
  Bottom Layer w0.254: U6.16 56.37,79.87 57.11,79.13 60.03,79.13 60.71,78.45 v1(60.71,74.82)
D14: length 50.2
  Top Layer w0.254: v1(60.09,76.29) 62.74,73.65 74.01,73.65 77.58,70.08 77.58,57.39 78.07,56.9 80.36,56.9 P2.6
  Bottom Layer w0.254: v1(60.09,76.29) 60.09,78.18 59.49,78.78 55.56,78.78 55.1,79.24 55.1,83.17 53.83,84.44
D15: length 54.1
  Top Layer w0.254: v1(59.85,73.97) 60.9,72.91 73.74,72.91 76.87,69.79 76.87,52.77 77.58,52.06 80.12,52.06 P2.10
  Bottom Layer w0.254: U6.18 53.83,78.92 54.32,78.42 58.53,78.42 58.91,78.04 58.91,74.79 59.74,73.97 v1(59.85,73.97)
NSLEEP: length 197.6
  Top Layer w0.457: DRV1.5 13.06,60.31 v1(13.19,58.28) ; v1(40.62,4.18) 40.37,4.18 39.1,5.45 SW8.3 29.3,3.37 R78.2 ; DRV2.5 v1(52.43,3.93) 53.27,4.76 v1(75.42,4.76) ; v1(83.67,65.39) 85.17,66.48
  Bottom Layer w0.457: v1(83.67,65.39) 84.69,60.69 91.68,48.25 96.75,47.11 98.53,43.93 97.52,40.25 v1(75.42,4.76) ; v1(40.62,4.18) 52.18,4.18 v1(52.43,3.93) ; v1(13.19,58.28) 8.49,46.6 9.93,44.12 9.93,44.1 26.96,15.06 26.96,15.03 22.84,10.91 22.84,8.12 25.51,5.44 SW8.3
$3N5765: length 2.7
  Top Layer w0.254: R3.2 36.62,59.66 Q1.1
$3N5766: length 4.2
  Top Layer w0.254: Q1.3 38.7,62.66 BUZZER3.2
$3N5940: length 7.2
  Top Layer w0.254: BUZZER3.1 37.9,67.89 R2.2
$3N5970: length 3.9
  Top Layer w0.254: R77.1 26.14,38.33 CSI1.7
$3N6012: length 5.7
  Top Layer w0.254: 62.85,79.24 62.85,83.3 63.99,84.44
$3N6112: length 3.5
  Top Layer w0.762: LED12.2 29.91,23.13 R62.1
$3N6115: length 4.3
  Top Layer w0.254: R63.1 17.33,36.61 19.5,34.45 LED13.2
$3N6127: length 4.2
  Top Layer w0.762: LED10.2 73.6,22.91 72.08,24.42 72.08,24.42 71.76,24.73 71.76,24.74 R67.1
$3N36316: length 4
  Top Layer w0.254: R73.1 93.27,34.55
$3N36361: length 3.9
  Top Layer w0.254: C13.1 87.19,24.42
$3N36406: length 4
  Top Layer w0.254: C1.1 R75.1
$3N36446: length 4
  Top Layer w0.254: C15.1 79.2,10.85
$3N48482: length 7.9
  Top Layer w0.254: 27.56,2.03 27.97,2.03 29.57,0.43 32.17,0.43 33.06,1.32 LED14.2

## Copper pours and planes (outline as drawn; the poured copper is in the pictures)
GND on Top Layer: -2.69,89.27 102.34,89.27 102.34,-4.96 -2.69,-4.96
GND on Bottom Layer: -0.65,92.19 104.38,92.19 104.38,-2.04 -0.65,-2.04
VCCBAT on Top Layer: 20.05,24.75 24.11,17.64 17.51,13.7 13.44,20.69
$3N16320 on Top Layer: 13.19,36.56 20.05,24.88 13.19,20.69 6.31,32.69
$3N16320 on Bottom Layer: 13.32,36.69 20.17,25.01 13.32,20.82 6.44,32.82

Small or netless copper shapes (teardrops, artwork), in the pictures only: 196 on Top Layer, 80 on Bottom Layer

## Text on the board
Top Layer: 湖北文理学院 智能视觉组 / 湖文凤雏八队 5月25日 | 陈仁凯 / 张惟羲 / 何于顺
Top Silkscreen Layer: C6 | C8
